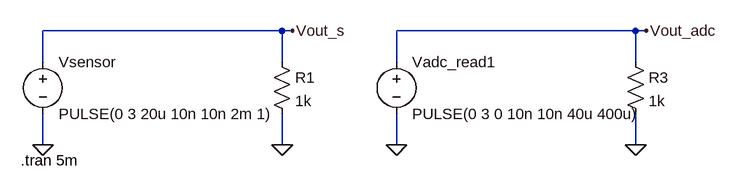
[diagram p0: schematic Task1-ADC-sampling-rate.asc]
Task1-ADC-sampling-rate.asc, the LTspice schematic file:
Version 4
SHEET 1 892 680
WIRE -320 48 -688 48
WIRE -304 48 -320 48
WIRE 224 48 -144 48
WIRE 240 48 224 48
WIRE -688 96 -688 48
WIRE -320 96 -320 48
WIRE -144 96 -144 48
WIRE 224 96 224 48
WIRE -688 224 -688 176
WIRE -320 224 -320 176
WIRE -144 224 -144 176
WIRE 224 224 224 176
FLAG -688 224 0
FLAG -320 224 0
FLAG -304 48 Vout_s
FLAG -144 224 0
FLAG 224 224 0
FLAG 240 48 Vout_adc
SYMBOL voltage -688 80 R0
WINDOW 123 0 0 Left 0
WINDOW 39 0 0 Left 0
SYMATTR InstName Vsensor
SYMATTR Value PULSE(0 3 20u 10n 10n 2m 1)
SYMBOL res -336 80 R0
SYMATTR InstName R1
SYMATTR Value 1k
SYMBOL voltage -144 80 R0
WINDOW 123 0 0 Left 0
WINDOW 39 0 0 Left 0
SYMATTR InstName Vadc_read1
SYMATTR Value PULSE(0 3 0 10n 10n 40u 400u)
SYMBOL res 208 80 R0
SYMATTR InstName R3
SYMATTR Value 1k
TEXT -722 248 Left 2 !.tran 5m

The netlist it stands for:
* Task1-ADC-sampling-rate.asc
Vsensor Vout_s 0 PULSE(0 3 20u 10n 10n 2m 1)
R1 Vout_s 0 1k
Vadc_read1 Vout_adc 0 PULSE(0 3 0 10n 10n 40u 400u)
R3 Vout_adc 0 1k
.tran 5m
.backanno
.end